# Altium schematic sheet BlockDiagram.SchDoc
size A3; SheetNumber: 1; SheetTotal: 2
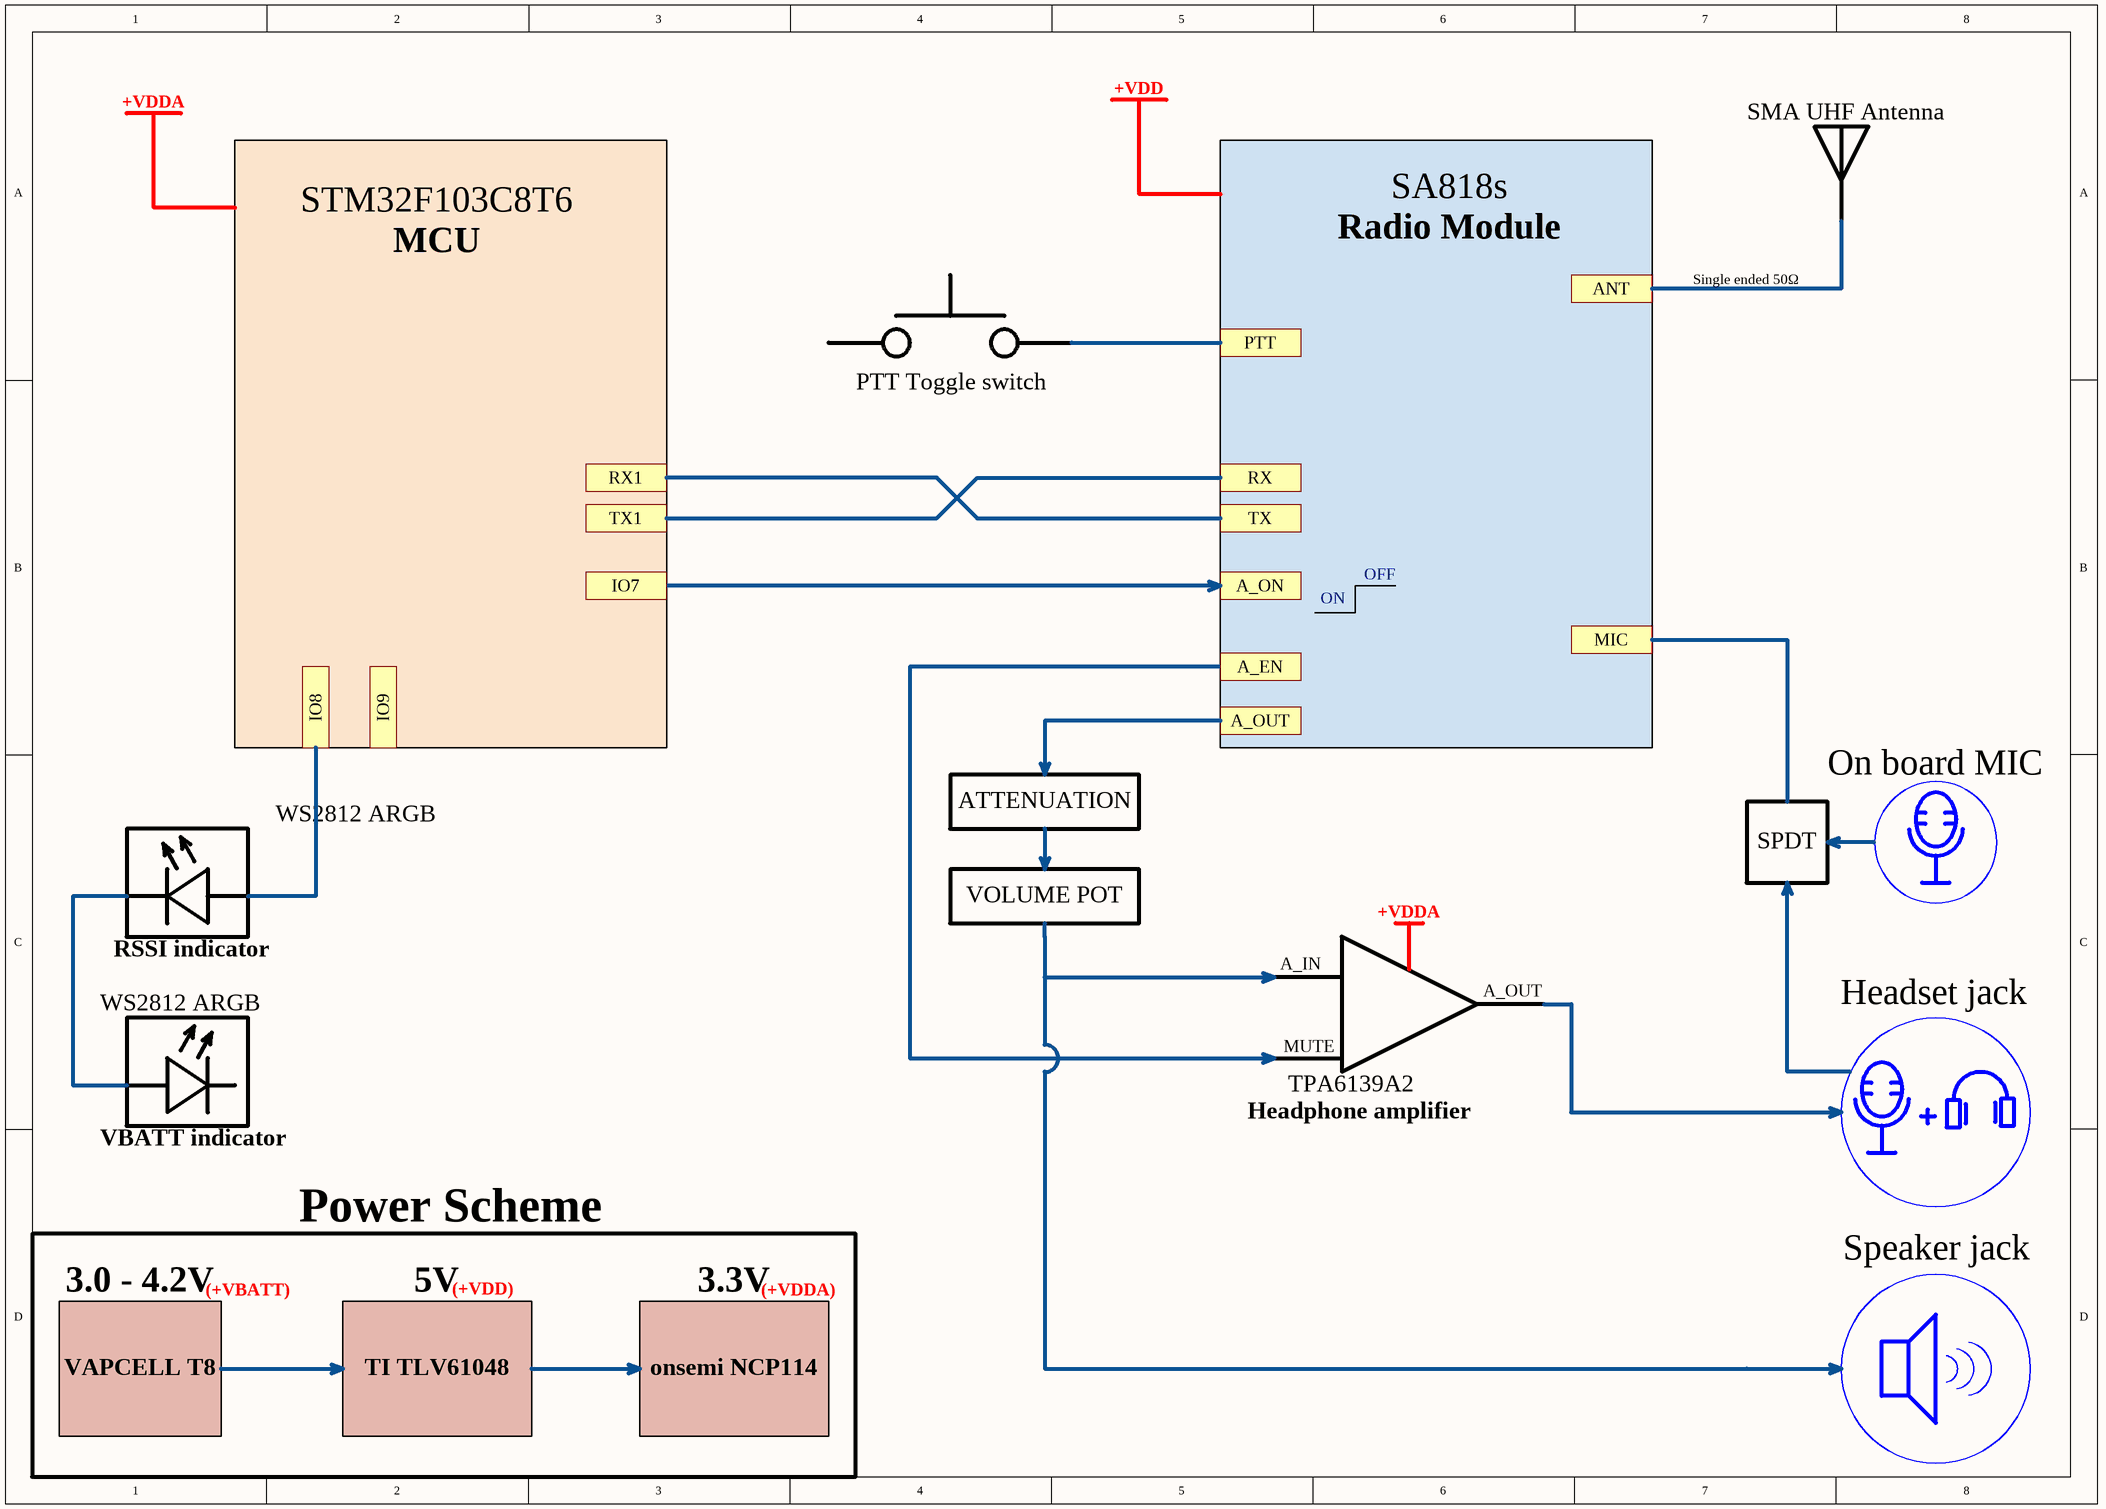
[diagram p0: BlockDiagram.SchDoc]

## Notes on the sheet
- +VDDA
- +VDD
- SMA UHF Antenna
- STM32F103C8T6
- SA818s
- Radio Module
- MCU
- ANT
- Single ended 50Ω
- PTT
- PTT Toggle switch
- RX1
- TX1
- RX
- TX
- IO7
- A_ON
- OFF
- ON
- MIC
- IO8
- IO9
- A_OUT
- A_EN
- On board MIC
- WS2812 ARGB
- ATTENUATION
- SPDT
- VOLUME POT
- RSSI indicator
- A_IN
- MUTE
- Headset jack
- Headphone amplifier
- TPA6139A2
- VBATT indicator
- Power Scheme
- 3.0 - 4.2V
- (+VBATT)
- 5V
- (+VDD)
- 3.3V
- (+VDDA)
- Speaker jack
- VAPCELL T8
- TI TLV61048
- onsemi NCP114